# Altium schematic sheet Screens.SchDoc
size A4
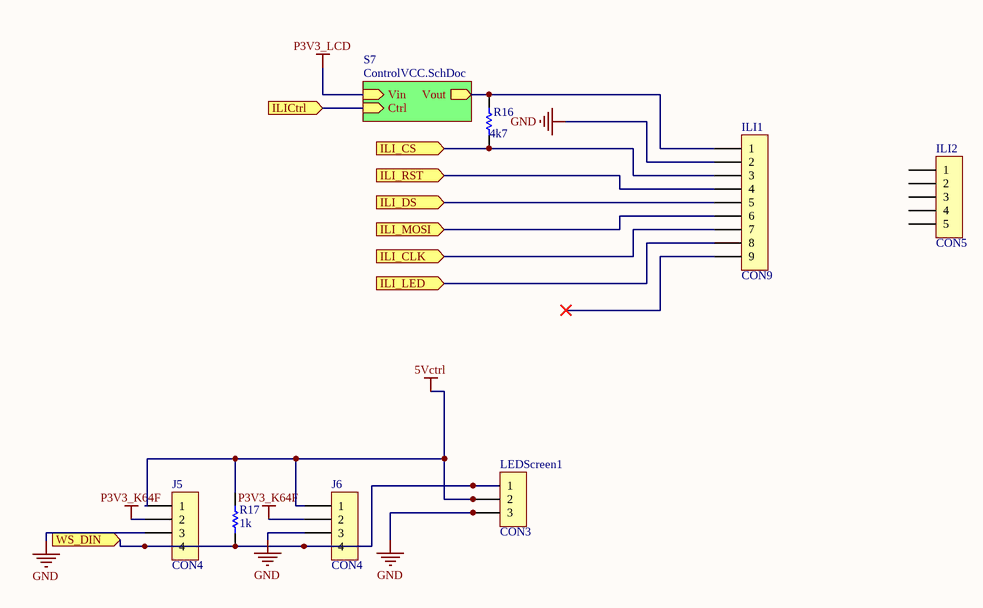
[diagram p0: Screens.SchDoc]

## Parts
ILI1  CON9  [SIP9]
ILI2  CON5  [SIP5]
J5  CON4  [SIP4]
J6  CON4  [SIP4]
LEDScreen1  CON3  [SIP3]
R16  4k7  [0805]
R17  1k  [0805]

## Sub-sheets
S7 = ControlVCC.SchDoc: Vin (in), Vout (out), Ctrl (in)

## Ports
ILI_CLK (in), ILI_CS (in), ILI_DS (in), ILI_LED (in), ILI_MOSI (in), ILI_RST (in), ILICtrl (in), WS_DIN (in)

## Nets
5Vctrl: J5.1 J6.1 LEDScreen1.2 R17.2
GND: ILI1.2 J5.3 J6.3 LEDScreen1.3
P3V3_K64F: J5.2 J6.2
P3V3_LCD: sheet S7/Vin
ILI_CLK: ILI1.7 ; port ILI_CLK
ILI_CS: ILI1.3 R16.1 ; port ILI_CS
ILI_DS: ILI1.5 ; port ILI_DS
ILI_LED: ILI1.8 ; port ILI_LED
ILI_MOSI: ILI1.6 ; port ILI_MOSI
ILI_RST: ILI1.4 ; port ILI_RST
ILICtrl: port ILICtrl, sheet S7/Ctrl
WS_DIN: J5.4 J6.4 LEDScreen1.1 R17.1 ; port WS_DIN
NetILI1_1: ILI1.1 R16.2 ; sheet S7/Vout

Not connected (* = marked no-connect by the designer): ILI1 9*; ILI2 1 2 3 4 5

## Library data of the parts
R16 R17 = RES